# EAGLE design keyless-esp32 (EAGLE 9.6.2)
REV: 1
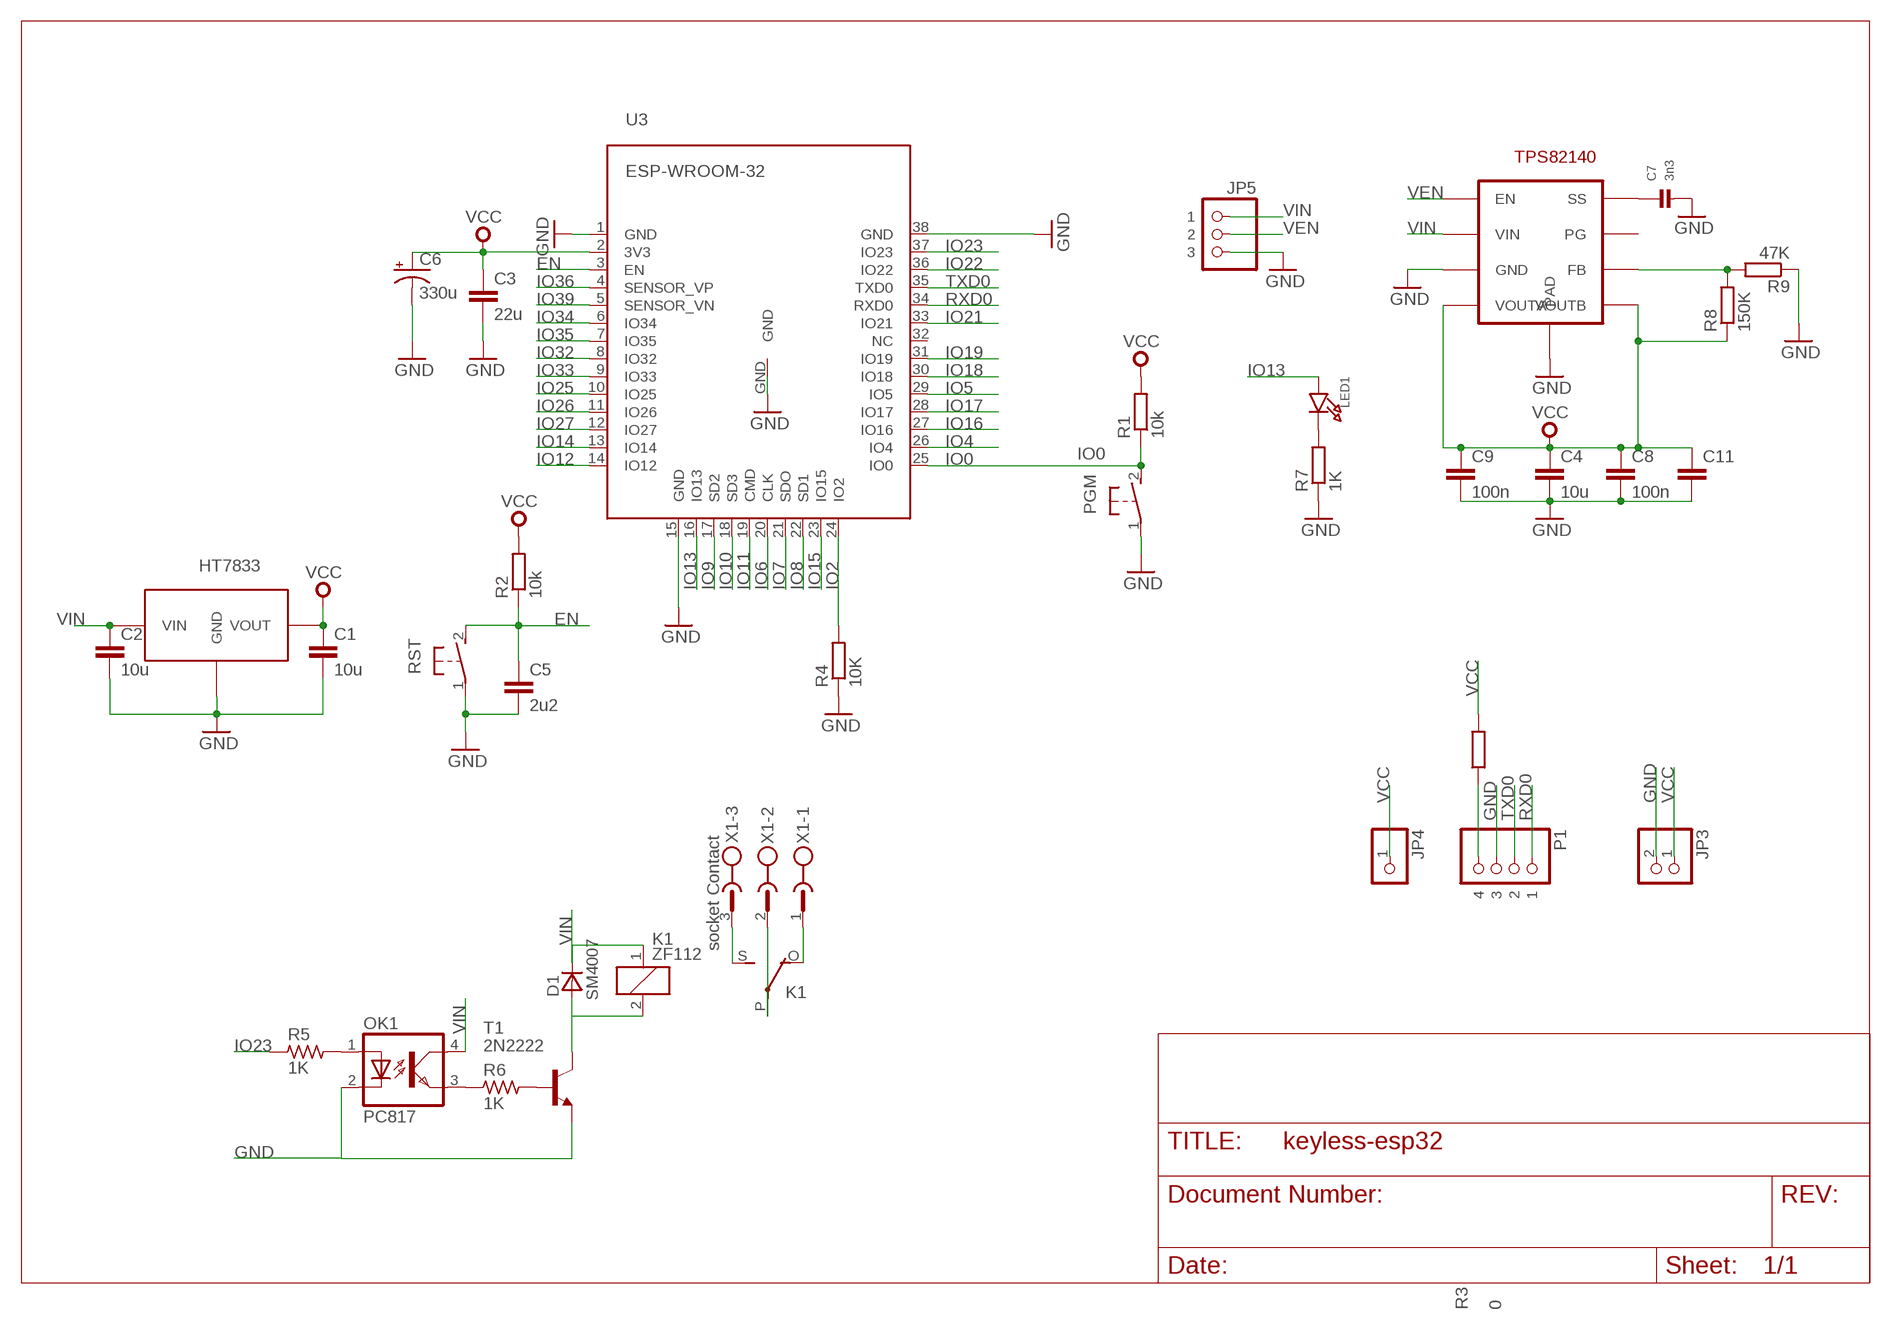
[diagram p0: schematic, sheet 1]

## Parts
C1  10u  C-EUC0603  [C0603]
C2  10u  C-EUC0603  [C0603]
C3  22u  CAP0805  [0805]
C4  10u  C-EUC0603  [C0603]
C5  2u2  C-EUC0603  [C0603]
C6  330u  CAP_POLSMD  [VISHAY_C]
C7  3n3  CAP_CERAMIC0603  [0603]
C8  100n  C-EUC0603  [C0603]
C9  100n  C-EUC0603  [C0603]
C11  CAPSMD  [GRM43D]
D1  SM4007  [MELF-MLL41]
JP3  HEADER-1X2ROUND  [1X02_ROUND]
JP4  HEADER-1X1ROUND  [1X01_ROUND]
JP5  HEADER-1X3ROUND  [1X03_ROUND]
K1  ZF112  [ZF112]
LED1  LED0603  [CHIPLED_0603]
OK1  PC817  [DIL04]
P1  HEADER-1X4ROUND  [1X04_ROUND]
PGM  DTSM-3  [DTSM-3]
R1  10k  R-EU_R0603  [R0603]
R2  10k  R-EU_R0603  [R0603]
R3  0  R-EU_R0603  [R0603]
R4  10K  R-EU_R0603  [R0603]
R5  1K  R_0805  [R0805]
R6  1K  R_0805  [R0805]
R7  1K  R-EU_R0603  [R0603]
R8  150K  R-EU_R0603  [R0603]
R9  47K  R-EU_R0603  [R0603]
RST  DTSM-3  [DTSM-3]
T1  2N2222  [TO18]
U3  ESP-WROOM-32  [ESP-WROOM-32]
U$1  HT7833  HT7333  [SOT89]
U$2  TPS82140  [TPS82140]
X1  socket Contact  W232-3  [W232-3]

## Nets
EN: C5.1 R2.1 RST.2 U3.3(EN)
GND [gnd]: C1.2 C2.2 C3.2 C4.2 C5.2 C6.- C7.2 C8.2 C9.2 C11.C JP3.2 JP5.3 OK1.2(C) P1.3 PGM.1 R4.1 R7.1 R9.1 RST.1 T1.1(E) U3.1(GND) U3.15(GND) U3.38(GND) U3.GND U$1.GND U$2.P$3(GND) U$2.P$9(PAD)
IO0: PGM.2 R1.1 U3.25(IO0)
IO2: R4.2 U3.24(IO2)
IO4: U3.26(IO4)
IO5: U3.29(IO5)
IO6: U3.20(CLK)
IO7: U3.21(SDO)
IO8: U3.22(SD1)
IO9: U3.17(SD2)
IO10: U3.18(SD3)
IO11: U3.19(CMD)
IO12: U3.14(IO12)
IO13: LED1.A U3.16(IO13)
IO14: U3.13(IO14)
IO15: U3.23(IO15)
IO16: U3.27(IO16)
IO17: U3.28(IO17)
IO18: U3.30(IO18)
IO19: U3.31(IO19)
IO21: U3.33(IO21)
IO22: U3.36(IO22)
IO23: R5.1 U3.37(IO23)
IO25: U3.10(IO25)
IO26: U3.11(IO26)
IO27: U3.12(IO27)
IO32: U3.8(IO32)
IO33: U3.9(IO33)
IO34: U3.6(IO34)
IO35: U3.7(IO35)
IO36: U3.4(SENSOR_VP)
IO39: U3.5(SENSOR_VN)
N$1: P1.4 R3.1
N$2: LED1.C R7.2
N$3: C7.1 U$2.P$8(SS)
N$4: R8.2 R9.2 U$2.P$6(FB)
N$5: R6.2 T1.2(B)
N$6: OK1.3(EMIT) R6.1
N$7: OK1.1(A) R5.2
N$8: K1.O(2:O) X1.1
N$9: K1.P(2:P) X1.2
N$10: D1.A K1.2 T1.3(C)
N$11: K1.S(2:S) X1.3
RXD0: P1.1 U3.34(RXD0)
TXD0: P1.2 U3.35(TXD0)
VCC [vcc]: C1.1 C3.1 C4.1 C6.+ C8.1 C9.1 C11.A JP3.1 JP4.1 R1.2 R2.2 R3.2 R8.1 U3.2(3V3) U$1.VOUT U$2.P$4(VOUTA) U$2.P$5(VOUTB)
VEN: JP5.2 U$2.P$1(EN)
VIN: C2.1 D1.C JP5.1 K1.1 OK1.4(COL) U$1.VIN U$2.P$2(VIN)
Unconnected: U3.32(NC) U$2.P$7(PG)

## Library data of the parts
C1 C2 C4 C5 C8 C9 = rcl:C-EU: CAPACITOR, European symbol
C3 C11 = SparkFun-Passives:CAP: Capacitor Standard 0603 ceramic capacitor, and 0.1" leaded capacitor.
C6 = SparkFun-Passives:CAP_POL: Capacitor Polarized These are standard SMD and PTH capacitors. Normally 10uF, 47uF, and 100uF in electrolytic and tantalum varieties. Always verify the external diameter of the through hole cap, it varies with capacity, voltage, and manufacturer. The EIA devices should be standard.
C7 = hari:CAP_CERAMIC: Ceramic Capacitors 0402 - 0402 Surface Mount Capacitors 0.1uF 10V 10% [Digikey: 490-1318-2-ND] 0603 - 0603 Surface Mount Capacitors 16 pF 50V 5% [Digikey: 445-5051-2-ND] 22 pF 50V [Digikey: PCC220ACVTR-ND] 33 pF 50V 5% [Digikey: 490-1415-1-ND] 56pF 50V 5% [Digikey: 490-1421-1-ND] 220pF 50V 5% [Digikey: 445-1285-1-ND] 680 pF 50V 2200 pF 50V 5% C0G [Digikey: 445-1297-1-ND] 5600 pF 100V 5% X7R [Digikey: 478-3711-1-ND] 0.1 µF 25V 10% [Digikey: PCC2277TR-ND] 0.22 µF 16V 10% X7R [Digikey: 445-1318-1-ND] 1.0 µF 25V 10% [Digikey: 445-5146-2-ND] 0603 - RF Specific 3pF 250V +/-0.1pF RF [Digikey: 712-1347-1-ND] 18 pF 250V 5% [Digikey: 478-3505-1-ND or 712-1322-1-ND] 56 pF 250V 5% C0G RF [Digikey: 490-4867-1-ND] 68 pF 250V RF [Digikey: 490-4868-1-ND] 0805 - 0805 Surface Mount Capacitors 220 pF 250V 2% RF Ceramic Capacitor [Digikey: 712-1398-1-ND] 1000 pF 50V 2% NP0 Ceramic Capacitor [Digikey: 478-3760-1-ND] 0.1 µF 25V 10% Ceramic Capacitor [Digikey: PCC1828TR-ND] 1.0 µF 16V 10% Ceramic Capacitor[Digikey: 490-1691-2-ND] 10.0 µF 10V 10% Ceramic Capacitor[Digikey: 709-1228-1-ND] 1206 - 1206 Surface Mount Capacitors
D1 = _mod_diode:SM400*: SM4001 .. SM4007 General Purpose Rectifier, 1 A SMD-Version of 1N4001 .. 1N4007 Case: MELF-MLL41 = DO 213 AB Author: Dipl.-Ing. FH Rainer Bayer HHN Hochschule Heilbronn, rainer.bayer@hs-heilbronn.de Ingenieurbüro ing-rb, mail@ing-rb.de
JP3 = hari:HEADER-1X2: PIN HEADER
JP4 = hari:HEADER-1X1: PIN HEADER
JP5 = hari:HEADER-1X3: PIN HEADER
K1 = relay:ZF112: RELAY 1 x switch; OC_FARNELL: unknown; OC_NEWARK: unknown
LED1 = hari:LED: LED 0603 - 0603 Surface Mount Package Green LED - Low Power (3.9mcd, 2ma, 1.7Vf) Orange LED - Low Power (9.8mcd, 2ma, 1.8Vf) Red LED - Low Power (5mcd, 2ma, 1.8Vf) Yellow LED - Low Power (7mcd, 2ma, 1.8Vf) 0805 - 0805 Surface Mount Package 20mA: Red LED (104mcd, 20mA, Diffused) - LS R976 [Digikey: 475-1278-6-ND] Red LED (12mcd, 20mA, 2.0Vf, Clear) - APT2012EC [Digikey: 754-1128-1-ND] Green LED (15mcd, 20mA, 2.2Vf, Clear) - APT2012GC [Digikey: 754-1131-1-ND] Orange LED (160mcd, 20mA, 2.1Vf, Clear) - APT2012SECK [Digikey: 754-1130-1-ND] 2mA: Red LED (8.8mcd, 2mA, 1.8Vf, Clear) - Low Power [Digikey: 475-2510-1-ND] Green LED (5mcd, 2mA, 1.8Vf, Clear) - Low Power [Digikey: 475-2730-1-ND] Yellow LED (11.3mcd, 2mA, 1.8Vf, Clear) - Low Power [Digikey: 475-2555-1-ND] 1206 - 1206 Surface Mount Package Green LED (26mcd, 20mA, Diffused) - LG N971 [Digikey: 475-1407-6-ND] Red LED (15mcd, 20mA, Diffused) - LH N974 [Digikey: 475-1416-6-ND]
OK1 = optocoupler:PC817: SHARP OPTO COUPLER; MPN: PC817X4J000F; OC_FARNELL: 9707727; OC_NEWARK: 97K7059
P1 = hari:HEADER-1X4: PIN HEADER
PGM RST = switch-tact:DTSM-3
R1-R4 R7-R9 = rcl:R-EU_: RESISTOR, European symbol
R5 R6 = rc-master-smd:R_: RESISTOR
T1 = transistor:2N2222: NPN TRANSISTOR
U3 = esp32:ESP-WROOM-32
U$1 = HT7333_SOT89:HT7333
U$2 = hari:TPS82140
X1 = con-wago-508:W232-3: WAGO SREW CLAMP; OC_FARNELL: unknown; OC_NEWARK: unknown

## Net classes
0 default: width 0.254 mm, drill 0.305 mm, clearance 0.152 mm
1 gnd: width 0.635 mm, drill 0.635 mm, clearance 0.254 mm
2 vcc: width 0.406 mm, drill 0.406 mm, clearance 0.254 mm

## Board
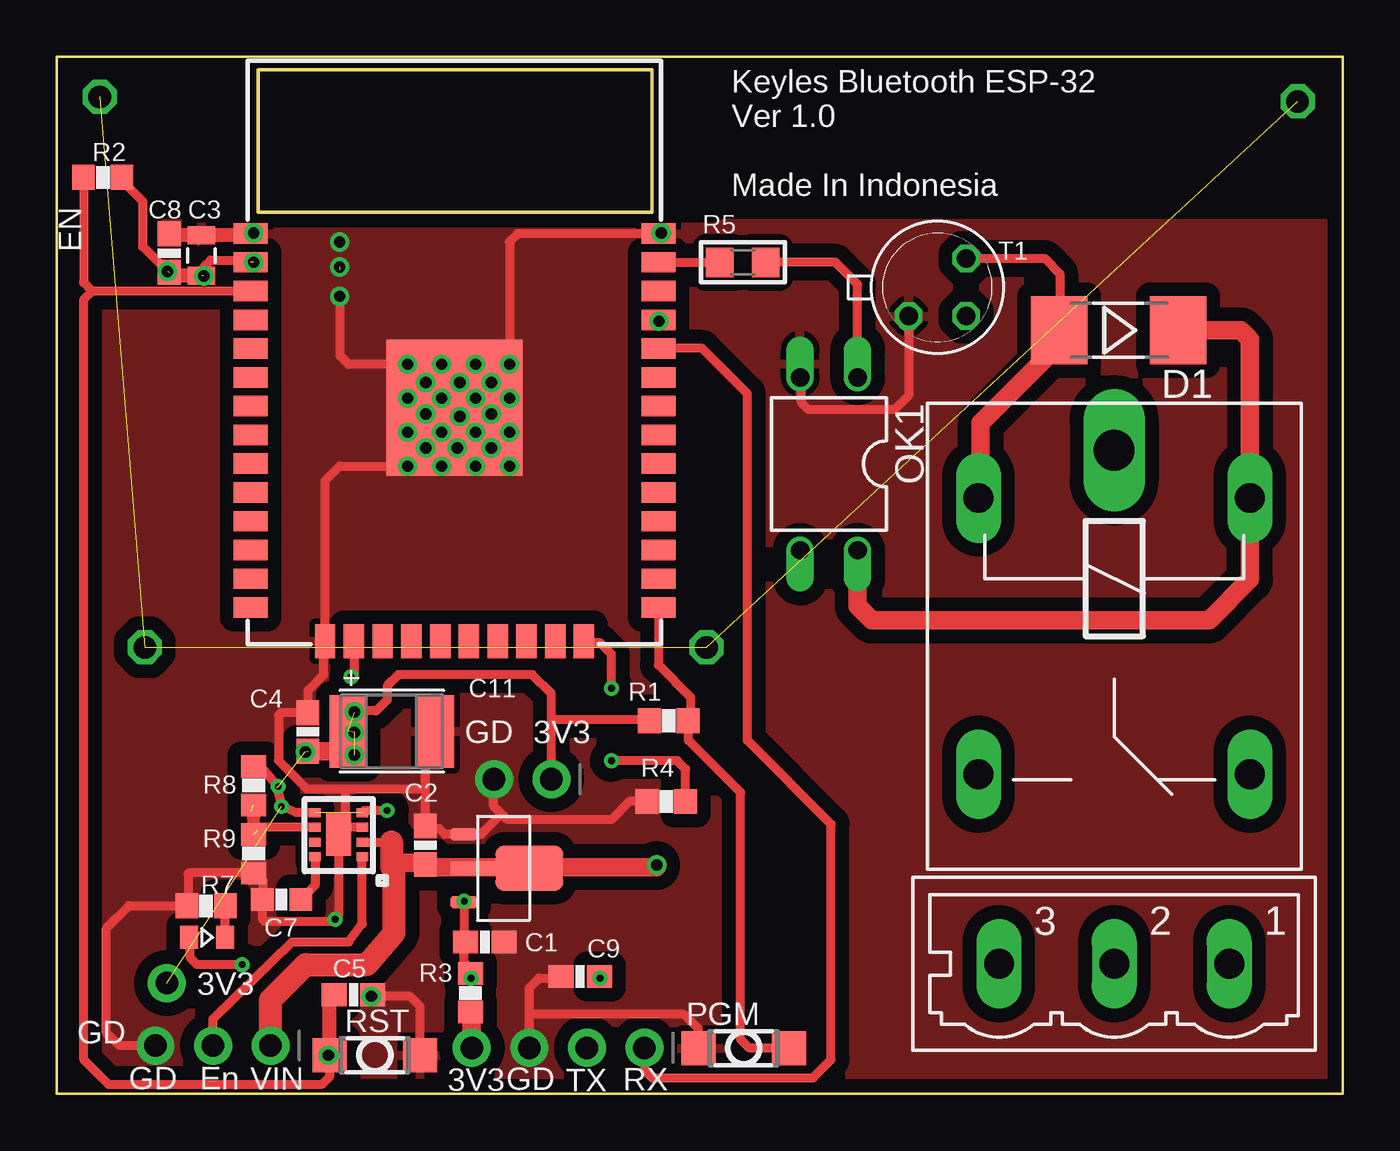
[diagram p1: board, top side]
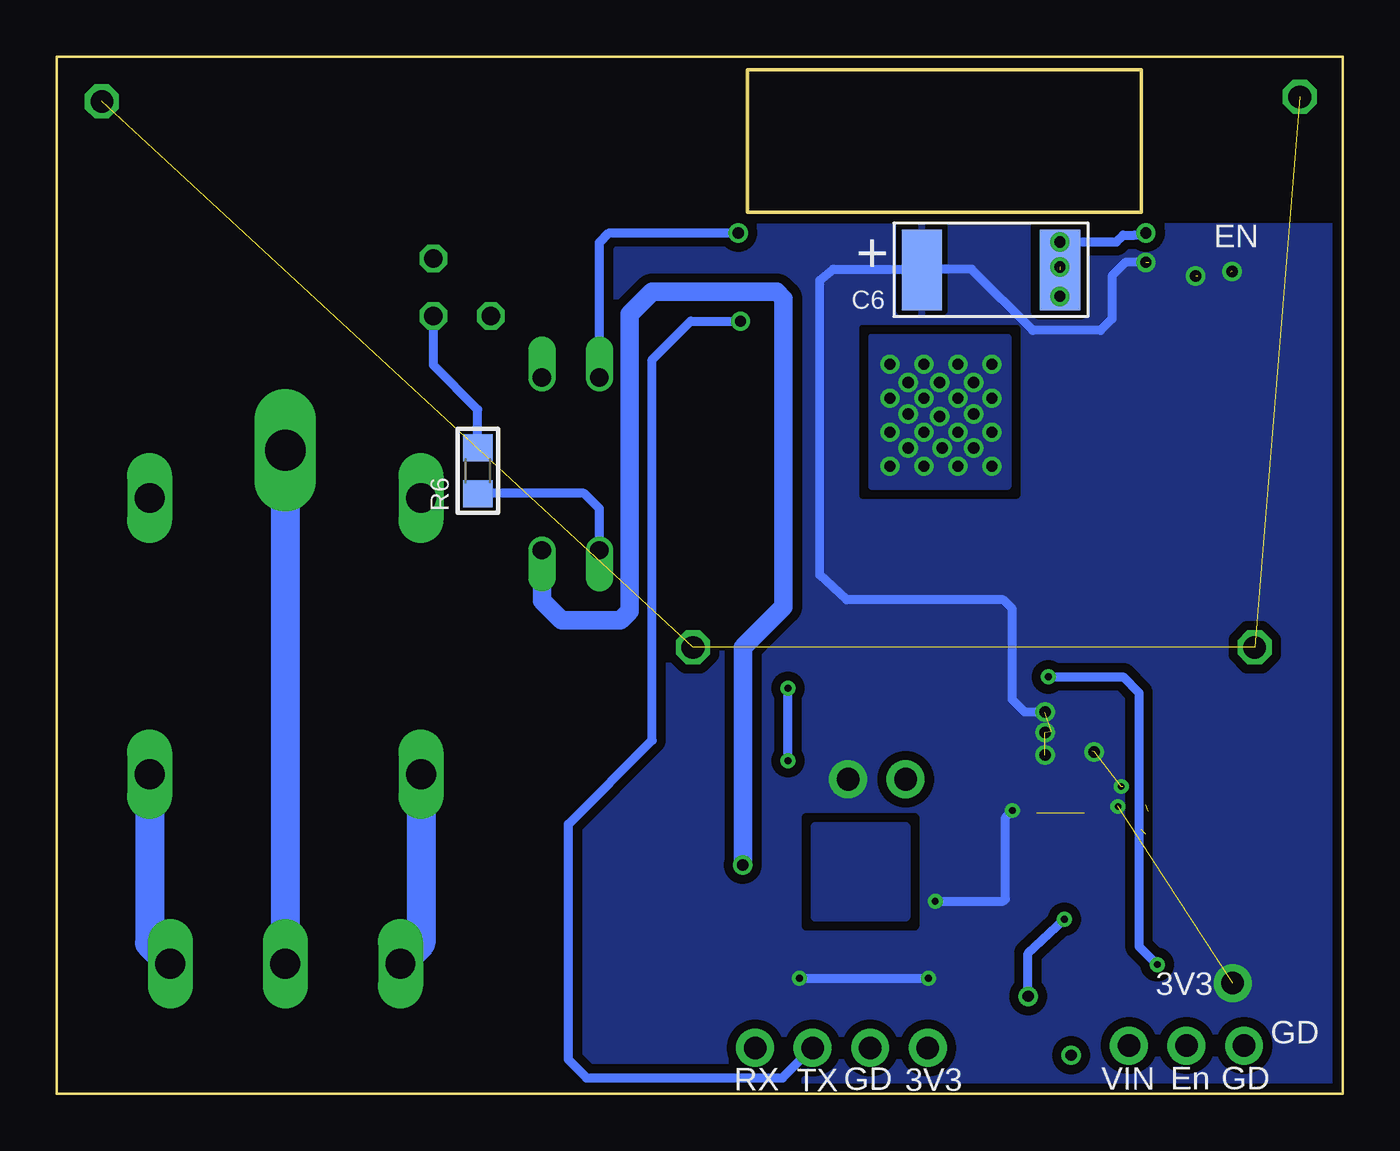
[diagram p2: board, bottom side, seen from below]

Size 56.8 x 45.78 mm. Coordinates in mm from the lower left corner, seen from the top.
Outline: 56.8,0 56.8,45.78 0,45.78 0,0 56.8,0
Outline: 8.9,38.9 8.9,45.2 26.3,45.2 26.3,38.9 8.9,38.9
Copper layers (1*16): Top 0.0356mm / dielectric 1.5011mm / Bottom 0.0356mm
Design rules "oshpark-2layer": minimum track width 6mil, minimum drill 13mil, track to track 6mil, track to pad 6mil, pad to pad 6mil, via to via 6mil, smd to smd 6mil, copper to edge 15mil, drill to drill 6mil, minimum pad ring 7mil, minimum via ring 7mil, stop-mask expansion 4mil, vias tented up to drill 0mil, thermal gap 10mil

### Footprints (pad centres in the part's own frame; a part is rotated, then mirrored left to right if it is on the bottom)
C0603 = smd 1.1 x 1: 1 -0.85,0; 2 0.85,0
0805 = smd 0.8 x 1.2: 1 -0.9,0; 2 0.9,0
VISHAY_C = smd 3.556 x 1.778: + 0,3.048; - 0,-3.048
0603 = smd 1 x 1: 1 -0.85,0; 2 0.85,0
GRM43D = smd 1.65 x 3.2: A 1.927,0; C -1.927,0
MELF-MLL41 = smd 2.5 x 3: A 2.625,0; C -2.625,0
1X02_ROUND = drill 1 pad 1.676: 1 -1.27,0; 2 1.27,0
1X01_ROUND = drill 1 pad 1.676: 1 0,0
1X03_ROUND = drill 1 pad 1.676: 1 -2.54,0; 2 0,0; 3 2.54,0
ZF112 = drill 1.321 long: 1 -6.096,5.994; 2 -6.096,-5.994; O 6.096,5.994; S 6.096,-5.994 | drill 1.803 long: P -8.204,0
CHIPLED_0603 = smd 1.016 x 0.8: A 0,-0.75; C 0,0.85
DIL04 = drill 0.813 offset: 1 -1.27,-3.81; 2 1.27,-3.81; 3 1.27,3.81; 4 -1.27,3.81
1X04_ROUND = drill 1 pad 1.676: 1 -3.81,0; 2 -1.27,0; 3 1.27,0; 4 3.81,0
DTSM-3 = smd 1.5 x 1.5: 1 -2,0; 2 2,0
R0603 = smd 1 x 1.1: 1 -0.85,0; 2 0.85,0
R0805 = smd 1.2 x 1.3: 1 -1.016,0; 2 1.016,0
TO18 = drill 0.813 octagon: 1 -1.27,-1.27; 2 1.27,-1.27; 3 1.27,1.27
ESP-WROOM-32 = smd 0.9 x 1.5: 1 7.7,9; 2 6.43,9; 3 5.16,9; 4 3.89,9; 5 2.62,9; 6 1.35,9; 7 0.08,9; 8 -1.19,9; 9 -2.46,9; 10 -3.73,9; 11 -5,9; 12 -6.27,9; 13 -7.54,9; 14 -8.81,9; 25 -8.81,-9; 26 -7.54,-9; 27 -6.27,-9; 28 -5,-9; 29 -3.73,-9; 30 -2.46,-9; 31 -1.19,-9; 32 0.08,-9; 33 1.35,-9; 34 2.62,-9; 35 3.89,-9; 36 5.16,-9; 37 6.43,-9; 38 7.7,-9 | smd 1.5 x 0.9: 15 -10.3,5.715; 16 -10.3,4.445; 17 -10.3,3.175; 18 -10.3,1.905; 19 -10.3,0.635; 20 -10.3,-0.635; 21 -10.3,-1.905; 22 -10.3,-3.175; 23 -10.3,-4.445; 24 -10.3,-5.715 | smd 6 x 6: GND 0,0
SOT89 = smd 0.559 x 1.194: GND -1.499,-0.597; VIN 0,-0.597; VOUT 1.499,-0.597 | smd 0.6 x 2: P$1 0,0.9 | smd 2 x 3: P$4 0,2.286
TPS82140 = smd 0.5 x 0.4: P$1 0,0; P$2 0,-0.65; P$3 0,-1.3; P$4 0,-1.95; P$5 2.1,-1.95; P$6 2.1,-1.3; P$7 2.1,-0.65; P$8 2.1,0 | smd 1.1 x 1.9: P$9 1.05,-1
W232-3 = drill 1.321 long: 1 -5.08,-0.635; 2 0,-0.635; 3 5.08,-0.635

### Placement (x,y rotation side)
C1  18.91,6.7 0 top
C2  16.29,10.97 90 top
C3  6.4,37 90 top
C4  11.1,15.97 90 top
C5  13.11,4.37 0 top
C6  15.54,36.37 90 bottom
C7  9.94,8.57 180 top
C8  4.97,37.11 90 top
C9  23.12,5.17 180 top
C11  14.8,16 180 top
D1  46.9,33.7 180 top
JP3  20.58,13.88 180 top
JP4  4.87,4.88 0 top
JP5  6.9,2.12 180 top
K1  46.7,20.2 270 top
LED1  6.6,6.9 270 top
OK1  34.1,27.8 180 top
P1  22.14,2.02 180 top
PGM  30.34,2.01 0 top
R1  27.03,16.46 180 top
R2  2.04,40.45 0 top
R3  18.28,4.45 90 top
R4  26.92,12.9 0 top
R5  30.3,36.7 0 top
R6  38.2,27.5 90 bottom
R7  6.6,8.29 0 top
R8  8.7,13.6 270 top
R9  8.7,10.6 90 top
RST  14.05,1.7 180 top
T1  38.9,35.6 0 top
U3  17.57,30.27 90 top
U$1  18.59,9.95 270 top
U$2  13.51,10.46 180 top
X1  46.7,5.1 180 top

### Tracks (layer width: path | path; a pad name or v marks a point on that pad's centre or on a via)
EN  (via drill 0.5)
  Top 0.406: C5.1 12.05,4.36 12.05,1.75 | U3.3 1.57,35.43 | 1.57,35.43 1.19,35.81 R2.1 | 12.05,1.75 v12,1.7 | 12.05,1.75 12.05,0.75 11.7,0.4 2.3,0.4 1.2,1.5 1.2,35.06 1.57,35.43
  Top 0.61: RST.2 12.05,4.36
GND  (via drill 0.3, 0.5)  (1 unrouted)
  Top 0.406: U$2.P$3 12.76,11.76 | 12.76,11.76 U$2.P$9 12.46,7.96 12.35,7.85 | JP5.3 2.78,2.12 2.2,2.7 2.2,7.3 3.2,8.3 R7.1 5.8,8.34 5.8,9.7 5.85,9.75 R9.1 8.75,9.75 9.1,9.4 9.1,8.59 C7.2 9.1,8.56 9.1,7.7 9.2,7.6 12.1,7.6 12.35,7.85 | R4.1 25.3,12.9 24.5,12.1 19.9,12.1 19.65,12.35 | 19.65,12.35 19.3,12.7 JP3.2 | 16.29,13.4 C2.2 16.41,11.7 16.9,11.7 17.15,11.45 U$1.GND 18.75,11.45 19.65,12.35 | 16.29,13.4 16.29,15.19 16.6,15.5 16.6,15.87 C11.C | P1.3 20.87,3.6 | 20.87,3.6 20.87,4.67 21.3,5.1 22.2,5.1 C9.2 | PGM.1 28.34,2.86 27.7,3.5 20.97,3.5 20.87,3.6 | v15.5,27.7 12.5,27.7 11.86,27.06 U3.15 11.8,19.91 11.8,18.5 11.1,17.8 C4.2 9.92,16.82 9.8,16.7 9.8,14.7 11.04,13.46 12.6,13.46 | v8.7,38 8.6,38 U3.1 | v12.5,35.2 12.5,32.6 12.9,32.2 v15.5,32.2 | v20,32.2 20,37.6 20.37,37.97 U3.38 26.6,38 v26.7,38 | RST.1 16.05,3.85 15.6,4.3 14.02,4.3 C5.2 13.96,4.64 v13.9,4.3 | v12.3,7.7 12.35,7.85 | 12.6,13.46 16.23,13.46 16.29,13.4 | 12.76,11.76 12.76,13.3 12.6,13.46 | T1.1 37.63,30.83 37,30.2 33.2,30.2 32.9,30.5 32.9,31.54 OK1.2
  Top 0.61: U3.1 8.73,37.87 8.4,37.9 C3.2 5.11,37.9 C8.2
  Bottom 0.406: v12.5,37.6 10,37.6 9.7,37.9 9.2,37.9 v8.7,38 | v13.9,4.3 13.9,6.2 v12.3,7.7 | OK1.2 32.83,37.57 32.4,38 v26.7,38
  other vias: 12.5,36.5 17,32.2 18.5,32.2 15.5,30.7 17,30.7 18.5,30.7 15.5,29.2 17,29.2 18.5,29.2 17,27.7 18.5,27.7 20,30.7 20,29.2 20,27.7 17.8,31.4 19.2,31.4 16.3,31.4 16.3,30 17.8,29.9 19.2,30 16.3,28.5 17.7,28.5 19.2,28.5
  pour Top (isolate 0.61): 0.5,0.6 56.1,0.6 56.1,38.4 0.5,38.4
  pour Bottom (isolate 0.406): 14.8,26.8 20.8,26.8 20.8,32.8 14.8,32.8
  pour Bottom (isolate 0.406): 14.8,27.4 20.8,27.4 20.8,33.4 14.8,33.4
IO0
  Top 0.406: U3.25 26.57,18.93 28,17.5 28,16.58 R1.1 27.9,16.45 27.9,15.6 30.2,13.3 30.2,2.4 30.59,2.01 PGM.2
IO2  (via drill 0.3)
  Top 0.406: R4.2 27.77,14.33 27.4,14.7 v24.5,14.7 | v24.5,17.9 24.5,19.4 24,19.9 23.36,19.9 U3.24
  Bottom 0.406: v24.5,14.7 v24.5,17.9
IO13  (via drill 0.3)
  Top 0.406: U3.16 13.13,18.53 v13,18.4 | v8.2,5.7 6.2,5.7 5.9,6 5.9,6.85 LED1.A
  Bottom 0.406: v13,18.4 9.7,18.4 9,17.7 9,6.5 v8.2,5.7
IO23
  Top 0.406: U3.37 R5.1
N$1
  Top 0.406: R3.1 18.33,3.6
  Top 0.813: 18.33,3.6 P1.4
N$2
  Top 0.406: LED1.C R7.2
N$3
  Top 0.406: U$2.P$8 11.41,9.19 C7.1
N$4  (2 unrouted)
  Top 0.406: U$2.P$6 8.66,11.76 | 8.66,11.76 8.58,12.47 8.9,11.65 | 8.66,11.76 8.86,12.43
N$5
  Bottom 0.406: R6.2 38.2,30.2 40.17,32.17 T1.2
N$6
  Bottom 0.406: OK1.3 32.83,25.83 33.5,26.5 38.18,26.5 R6.1
N$7
  Top 0.406: OK1.1 35.37,35.73 34.4,36.7 R5.2
N$8
  Bottom 1.27: K1.O 52.69,6.65 X1.1
N$9
  Bottom 1.27: K1.P X1.2
N$10
  Top 0.406: T1.3 43.63,36.87 44.3,36.2 44.3,33.72 D1.A
  Top 0.813: D1.A 44.27,33.07 40.8,29.6 40.8,26.39 K1.2
N$11
  Bottom 1.27: K1.S 40.71,6.65 X1.3
N$13  (via drill 1 pad 1.3)  (3 unrouted)
  other vias: 1.9,44 54.8,43.8 28.7,19.7 3.9,19.7
RXD0
  Top 0.406: P1.1 25.95,1.05 26.3,0.7 33.4,0.7 34.2,1.5 34.2,11.9 30.5,15.6 30.5,30.9 28.5,32.9 U3.34
TXD0  (via drill 0.5)
  Top 0.406: v26.6,34.1 26.63,34.1 U3.35
  Bottom 0.406: P1.2 24.74,0.7 33.4,0.7 34.2,1.5 34.2,11.9 30.5,15.6 30.5,32.4 28.8,34.1 v26.6,34.1
VCC  (via drill 0.3, 0.5)  (11 unrouted)
  Top 0.305: R2.2 2.89,40.31
  Top 0.406: U$1.VOUT 18,8.35 | U$2.P$5 10.59,12.41 v9.93,12.68 9.71,13.55 | R8.1 9,14.45 v9.79,13.56 | 2.89,40.31 3.8,39.4 3.8,37.4 v4.9,36.3 | 12.6,15.12 12.6,15.1 13.15,15.1 v13.15,14.95 | U$1.VOUT 17.99,6.77 C1.1 18,6.64 18,5.8 18.28,5.52 R3.2 18.48,5.1 v18.3,5.1 | C9.1 23.77,5.17 v24,5.1 | JP3.1 21.85,16.4 | 21.85,16.4 21.85,17.65 21,18.5 15.1,18.5 14.6,18 14.6,17.4 14.1,16.9 13.2,16.9 v13.15,16.85 | R1.2 26.15,16.5 21.95,16.5 21.85,16.4 | v6.5,36.1 6.5,36.5 6.8,36.8 8.47,36.8 U3.2 | U$1.VOUT 17.95,8.55 v18,8.5 | v14.6,12.5 13.6,12.5 U$2.P$4
  Top 0.61: C3.1 5.13,36.1 C8.1
  Top 0.813: C4.1 12.6,15.12
  Bottom 0.406: v24,5.1 v18.3,5.1 | v13.15,16.85 14.05,16.85 14.6,17.4 14.6,21.4 15,21.8 21.9,21.8 23.1,22.9 23.1,35.9 22.5,36.4 18.62,36.4 | 18.62,36.4 C6.+ | v8.7,36.7 9.6,36.7 10.2,36.1 10.2,34.2 10.7,33.7 13.7,33.7 16.4,36.4 18.62,36.4 | v18,8.5 15,8.5 14.9,8.6 14.9,12.2 v14.6,12.5
  other vias: 10.98,15.09 13.15,15.95
  pour Bottom (isolate 0.406, rank 2): 0.3,0.3 56.1,0.4 56.1,38.4 0.3,38.3
VEN
  Top 0.406: JP5.2 6.9,3.3 10.4,6.7 12.9,6.7 13.5,7.5 U$2.P$1
VIN  (via drill 0.5)
  Top 0.406: 16.29,9.95 C2.1 16.21,10.2 | U$2.P$2 14.79,11.11 | 14.8,10 15.2,10.2 14.9,9.9
  Top 0.5: C2.1 16.48,10.12 16.55,9.97 | 17.89,9.97 U$1.VIN
  Top 0.61: 16.55,9.97 17.89,9.97
  Top 0.813: 15.2,10.2 16.21,10.2 | v26.5,10.1 26.5,10 16.41,10 C2.1 | D1.C 52.3,33.7 52.7,33.3 K1.1 52.7,22.7 50.9,20.9 36,20.9 35.37,21.53 OK1.4
  Top 1.016: 14.79,11.11 14.8,10 | JP5.1 9.44,4.14 11,5.7 13.7,5.7 14.9,7.1 14.9,9.9
  Bottom 0.813: OK1.4 35.37,21.77 34.5,20.9 31.9,20.9 31.5,21.3 31.5,34.4 30.5,35.4 25,35.4 24.7,35.1 24.7,21.5 26.5,19.7 v26.5,10.1
  pour Bottom: 19.3,11.3 19.3,7.8 23.3,7.8 23.3,11.8 19.3,11.8

### Text on the board
tNames: Keyles Bluetooth ESP-32 / Ver 1.0 / / Made In Indonesia | EN | + | GD | 3V3 | 3V3 | GD | GD | En | VIN | 3V3 | GD | TX | RX
bNames: EN | 3V3 | GD | GD | En | VIN | 3V3 | GD | TX | RX